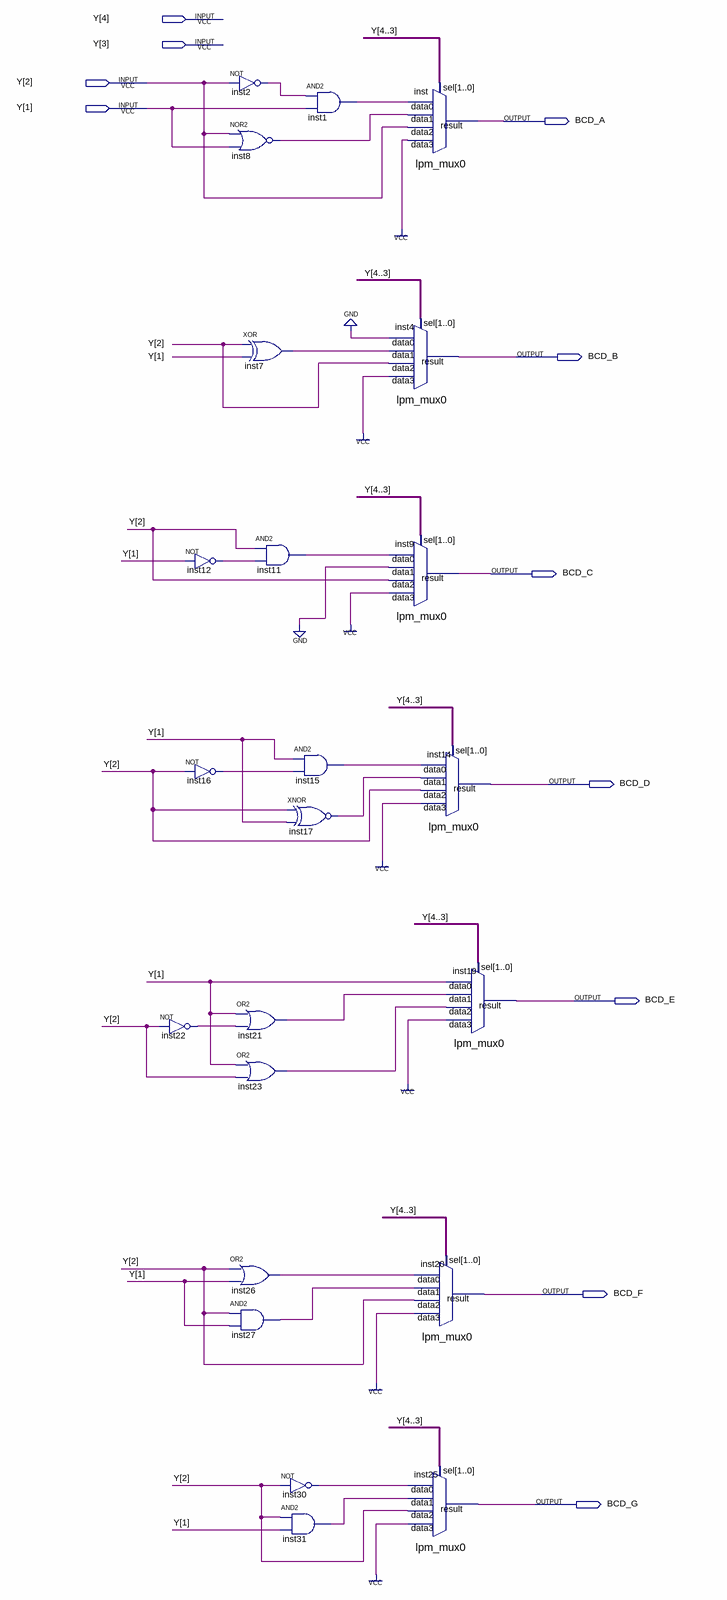
[diagram p0: schematic sheet]
// Quartus schematic BCD7SEG.bdf as structural Verilog: 23 symbols, 11 pins
module BCD7SEG (
  input  [4:1] Y,
  output BCD_A,
  output BCD_B,
  output BCD_C,
  output BCD_D,
  output BCD_E,
  output BCD_F,
  output BCD_G
);

  wire inst1_out, inst2_out, inst7_out, inst8_out, inst11_out, inst12_out, inst15_out, inst16_out,
       inst17_out, inst21_out, inst22_out, inst23_out, inst26_out, inst27_out, inst30_out, inst31_out;

  not inst22 (inst22_out, Y[2]);
  not inst2 (inst2_out, Y[2]);
  nor inst8 (inst8_out, Y[2], Y[1]);
  not inst12 (inst12_out, Y[1]);
  not inst16 (inst16_out, Y[2]);
  or inst26 (inst26_out, Y[2], Y[1]);
  and inst27 (inst27_out, Y[2], Y[1]);
  xor inst7 (inst7_out, Y[2], Y[1]);
  and inst11 (inst11_out, Y[2], inst12_out);
  or inst21 (inst21_out, Y[1], inst22_out);
  or inst23 (inst23_out, Y[1], Y[2]);
  not inst30 (inst30_out, Y[2]);
  and inst31 (inst31_out, Y[2], Y[1]);
  and inst1 (inst1_out, inst2_out, Y[1]);
  and inst15 (inst15_out, Y[1], inst16_out);
  xnor inst17 (inst17_out, Y[2], Y[1]);
  lpm_mux0 inst (.data3(1'b1), .data2(Y[2]), .data1(inst8_out), .data0(inst1_out), .sel(Y[4:3]), .result(BCD_A));
  lpm_mux0 inst4 (.data3(1'b1), .data2(Y[2]), .data1(inst7_out), .data0(1'b0), .sel(Y[4:3]), .result(BCD_B));
  lpm_mux0 inst9 (.data3(1'b1), .data2(Y[2]), .data1(1'b0), .data0(inst11_out), .sel(Y[4:3]), .result(BCD_C));
  lpm_mux0 inst14 (.data3(1'b1), .data2(Y[2]), .data1(inst17_out), .data0(inst15_out), .sel(Y[4:3]), .result(BCD_D));
  lpm_mux0 inst20 (.data3(1'b1), .data2(Y[2]), .data1(inst27_out), .data0(inst26_out), .sel(Y[4:3]), .result(BCD_F));
  lpm_mux0 inst25 (.data3(1'b1), .data2(Y[2]), .data1(inst31_out), .data0(inst30_out), .sel(Y[4:3]), .result(BCD_G));
  lpm_mux0 inst19 (.data3(1'b1), .data2(inst23_out), .data1(inst21_out), .data0(Y[1]), .sel(Y[4:3]), .result(BCD_E));
endmodule
